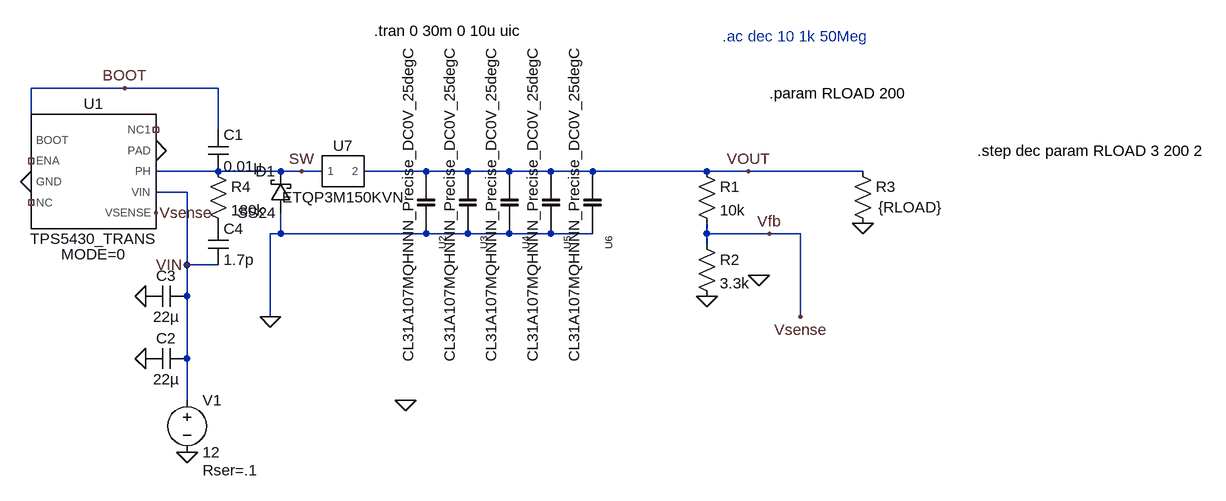
[diagram p0: schematic power.asc]
power.asc, the LTspice schematic file:
Version 4
SHEET 1 1844 680
WIRE 160 64 16 64
WIRE 304 64 160 64
WIRE 304 128 304 64
WIRE 16 144 16 64
WIRE 304 192 208 192
WIRE 400 192 304 192
WIRE 432 192 400 192
WIRE 464 192 432 192
WIRE 624 192 528 192
WIRE 688 192 624 192
WIRE 752 192 688 192
WIRE 816 192 752 192
WIRE 880 192 816 192
WIRE 1056 192 880 192
WIRE 1120 192 1056 192
WIRE 1296 192 1120 192
WIRE 256 224 208 224
WIRE 400 288 400 256
WIRE 400 288 384 288
WIRE 624 288 400 288
WIRE 688 288 624 288
WIRE 752 288 688 288
WIRE 816 288 752 288
WIRE 880 288 816 288
WIRE 1056 288 1056 272
WIRE 1152 288 1056 288
WIRE 1200 288 1152 288
WIRE 1056 304 1056 288
WIRE 256 336 256 224
WIRE 304 336 256 336
WIRE 256 384 256 336
WIRE 384 416 384 288
WIRE 1200 416 1200 288
WIRE 256 480 256 384
WIRE 256 544 256 480
FLAG 16 208 0
FLAG 208 160 0
FLAG 384 416 0
FLAG 432 192 SW
FLAG 1056 384 0
FLAG 1200 416 Vsense
FLAG 208 256 Vsense
FLAG 256 624 0
FLAG 192 384 0
FLAG 192 480 0
FLAG 1296 272 0
FLAG 160 64 BOOT
FLAG 256 336 VIN
FLAG 1120 192 VOUT
FLAG 1152 288 Vfb
FLAG 1136 352 0
FLAG 592 544 0
SYMBOL cap 288 128 R0
SYMATTR InstName C1
SYMATTR Value 0.01µ
SYMATTR SpiceLine V=10 Irms=0 Rser=0.0697 Lser=689p mfg="Würth Elektronik" pn="885012208008 WCAP-CSGP 1206" type="X7R"
SYMBOL schottky 416 256 R180
WINDOW 0 24 64 Left 2
WINDOW 3 24 0 Left 2
SYMATTR InstName D1
SYMATTR Value SS24
SYMATTR Description Diode
SYMATTR Type diode
SYMBOL res 1040 176 R0
SYMATTR InstName R1
SYMATTR Value 10k
SYMBOL res 1040 288 R0
SYMATTR InstName R2
SYMATTR Value 3.3k
SYMBOL res 1280 176 R0
WINDOW 3 40 71 Left 2
SYMATTR InstName R3
SYMATTR Value {RLOAD}
SYMBOL voltage 256 528 R0
WINDOW 123 0 0 Left 0
WINDOW 39 24 124 Left 2
SYMATTR SpiceLine Rser=.1
SYMATTR InstName V1
SYMATTR Value 12
SYMBOL cap 256 464 R90
WINDOW 0 0 32 VBottom 2
WINDOW 3 32 32 VTop 2
SYMATTR InstName C2
SYMATTR Value 22µ
SYMATTR SpiceLine V=6.3 Irms=0 Rser=0.005 Lser=0 mfg="Murata" pn="GRM187R60J226ME15" type="X5R"
SYMBOL cap 256 368 R90
WINDOW 0 0 32 VBottom 2
WINDOW 3 32 32 VTop 2
SYMATTR InstName C3
SYMATTR Value 22µ
SYMATTR SpiceLine V=6.3 Irms=0 Rser=0.005 Lser=0 mfg="Murata" pn="GRM187R60J226ME15" type="X5R"
SYMBOL ETQP3M150KVN 496 192 R0
SYMATTR InstName U7
SYMBOL TPS5430_TRANS 112 192 R0
SYMATTR InstName U1
SYMBOL CL31A107MQHNNN_Precise_DC0V_25degC_LT 624 240 R90
SYMATTR InstName U2
SYMBOL CL31A107MQHNNN_Precise_DC0V_25degC_LT 688 240 R90
SYMATTR InstName U3
SYMBOL CL31A107MQHNNN_Precise_DC0V_25degC_LT 752 240 R90
SYMATTR InstName U4
SYMBOL CL31A107MQHNNN_Precise_DC0V_25degC_LT 816 240 R90
SYMATTR InstName U5
SYMBOL CL31A107MQHNNN_Precise_DC0V_25degC_LT 880 240 R90
SYMATTR InstName U6
SYMBOL res 288 176 R0
SYMATTR InstName R4
SYMATTR Value 180k
SYMBOL cap 288 272 R0
SYMATTR InstName C4
SYMATTR Value 1.7p
TEXT 1152 72 Left 2 !.param RLOAD 200
TEXT 544 -24 Left 2 !.tran 0 30m 0 10u uic
TEXT 1080 -16 Left 2 ;.ac dec 10 1k 50Meg
TEXT 1472 160 Left 2 !.step dec param RLOAD 3 200 2

The netlist it stands for:
* power.asc
C1 BOOT SW 0.01µ V=10 Irms=0 Rser=0.0697 Lser=689p mfg="Würth Elektronik" pn="885012208008 WCAP-CSGP 1206" type="X7R"
D1 0 SW SS24
R1 VOUT Vfb 10k
R2 Vfb 0 3.3k
R3 VOUT 0 {RLOAD}
V1 VIN 0 12 Rser=.1
C2 VIN 0 22µ V=6.3 Irms=0 Rser=0.005 Lser=0 mfg="Murata" pn="GRM187R60J226ME15" type="X5R"
C3 VIN 0 22µ V=6.3 Irms=0 Rser=0.005 Lser=0 mfg="Murata" pn="GRM187R60J226ME15" type="X5R"
XU7 SW VOUT ETQP3M150KVN  ; pins 1 2
XU1 BOOT NC_01 0 NC_02 NC_03 0 SW VIN Vfb TPS5430_TRANS MODE=0  ; pins BOOT ENA GND NC NC1 PAD PH VIN VSENSE
XU2 0 VOUT CL31A107MQHNNN_Precise_DC0V_25degC  ; pins A B
XU3 0 VOUT CL31A107MQHNNN_Precise_DC0V_25degC  ; pins A B
XU4 0 VOUT CL31A107MQHNNN_Precise_DC0V_25degC  ; pins A B
XU5 0 VOUT CL31A107MQHNNN_Precise_DC0V_25degC  ; pins A B
XU6 0 VOUT CL31A107MQHNNN_Precise_DC0V_25degC  ; pins A B
R4 SW P001 180k
C4 P001 VIN 1.7p
.model D D
.lib standard.dio
.param RLOAD 200
.tran 0 30m 0 10u uic
* .ac dec 10 1k 50Meg
.step dec param RLOAD 3 200 2
.lib E:\Box\Box\BFR\MK11\09 Low Voltage\DAQ\SMU - Spatial Measurement Unit\SPICE\ETQP3M150KVN.lib
.lib E:\Box\Box\BFR\MK11\09 Low Voltage\DAQ\SMU - Spatial Measurement Unit\SPICE\TPS5430_TRANS.LIB
.lib CL31A107MQHNNN_Precise_DC0V_25degC_LT.mod
.backanno
.end